# Altium schematic sheet CurrentSource.SchDoc
size A4; DocumentNumber: 4; SheetNumber: 9; SheetTotal: 15
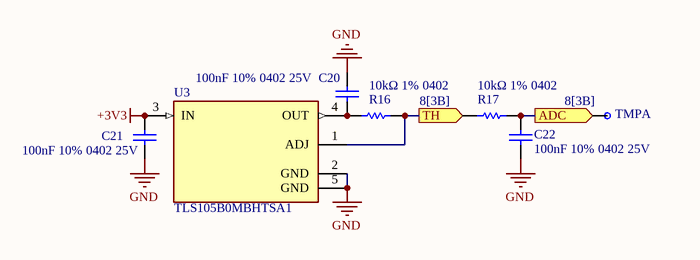
[diagram p0: CurrentSource.SchDoc]

## Parts
C20  100nF 10% 0402 25V  [0402N]
C21  100nF 10% 0402 25V  [0402N]
C22  100nF 10% 0402 25V  [0402N]
R16  10kΩ 1% 0402  [0402N]
R17  10kΩ 1% 0402  [0402N]
TMPA  Testpoint  [Testpoint-Footprint-1]  (value not drawn)  (no BOM)
U3  TLS105B0MBHTSA1  [FP-PG-SCT595-5-MFG]

## Ports
ADC (out, see 8[3B]), TH (out, see 8[3B])

## Nets
+3V3: C21.2 U3.3(IN)
GND: C20.1 C21.1 C22.1 U3.2(GND) U3.5(GND)
ADC: C22.2 R17.2 TMPA.1 ; port ADC
TH: R16.2 R17.1 U3.1(ADJ) ; port TH
NetC20_2: C20.2 R16.1 U3.4(OUT)

## Library data of the parts
C20-C22 = C0402: Capacitance: 100n; Tolerance: 10; Voltage: 25; Footprint: 0402
R16 R17 = R0402: Resistance: 10k; Tolerance: 1; Footprint: 0402
TMPA = CMP-003-000002-1
U3 = CMP-32856-000017-1: IC REG LIN POS ADJ 120MA SCT595; Accuracy: 0.1%; Watchdog Timer: No; Max Output Voltage: 20V; Output Configuration: Positive; Max Input Voltage: 40V; Max Supply Current: 5.5mA; Min Output Voltage: 2V; Number of Regulators: 1; Output Type: Adjustable; Power Supply Rejection Ratio (PSRR): 100dB; Output Current: 50mA; Quiescent Current: 40A; Dropout Voltage: 250mV; Mount: Surface Mount; Halogen Free: Not Halogen Free; Case/Package: SMD/SMT; Max Supply Voltage: 40V; Series: Automotive, AEC-Q100; Packaging: Cut Tape; Min Operating Temperature: -40°C; Max Operating Temperature: 150°C; Lead Free: Lead Free